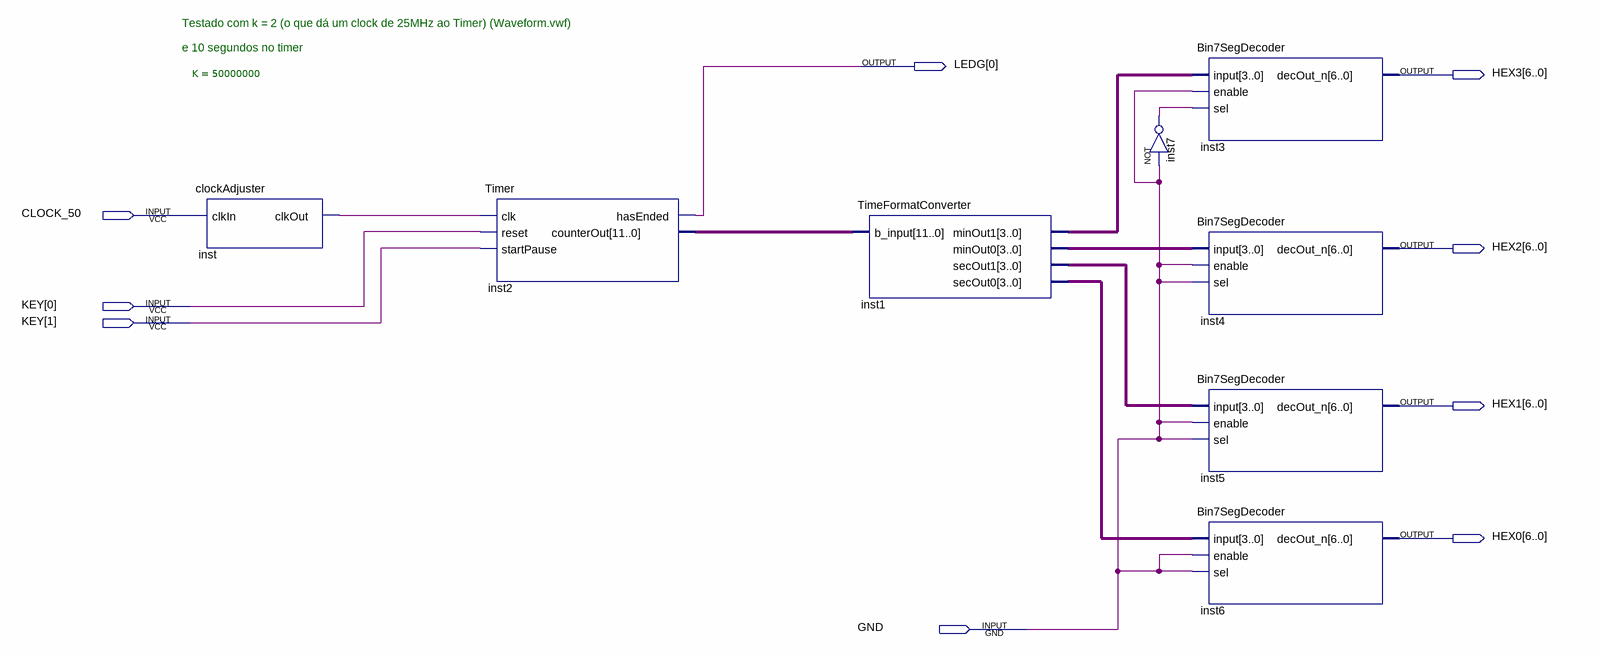
[diagram p0: schematic sheet]
// Quartus schematic Fase2.bdf as structural Verilog: 8 symbols, 9 pins
module Fase2 (
  input  CLOCK_50,
  input  [1:0] KEY,
  input  GND,
  output [0:0] LEDG,
  output [6:0] HEX3,
  output [6:0] HEX2,
  output [6:0] HEX1,
  output [6:0] HEX0
);

  wire inst7_out, inst_clkout;
  wire [3:0] inst1_minout0, inst1_minout1, inst1_secout0, inst1_secout1;
  wire [11:0] inst2_counterout;

  clockAdjuster #(.K(50000000)) inst (.clkIn(CLOCK_50), .clkOut(inst_clkout));
  Timer inst2 (
    .clk(inst_clkout), .reset(KEY[0]), .startPause(KEY[1]), .hasEnded(LEDG[0]), .counterOut(inst2_counterout));
  TimeFormatConverter inst1 (
    .b_input(inst2_counterout), .minOut1(inst1_minout1), .minOut0(inst1_minout0), .secOut1(inst1_secout1),
    .secOut0(inst1_secout0));
  not inst7 (inst7_out, GND);
  Bin7SegDecoder inst3 (.\input (inst1_minout1), .enable(GND), .sel(inst7_out), .decOut_n(HEX3));
  Bin7SegDecoder inst4 (.\input (inst1_minout0), .enable(GND), .sel(GND), .decOut_n(HEX2));
  Bin7SegDecoder inst5 (.\input (inst1_secout1), .enable(GND), .sel(GND), .decOut_n(HEX1));
  Bin7SegDecoder inst6 (.\input (inst1_secout0), .enable(GND), .sel(GND), .decOut_n(HEX0));

  // Notes on the sheet:
  //   Testado com k = 2 (o que dá um clock de 25MHz ao Timer) (Waveform.vwf)
  //   e 10 segundos no timer
endmodule
